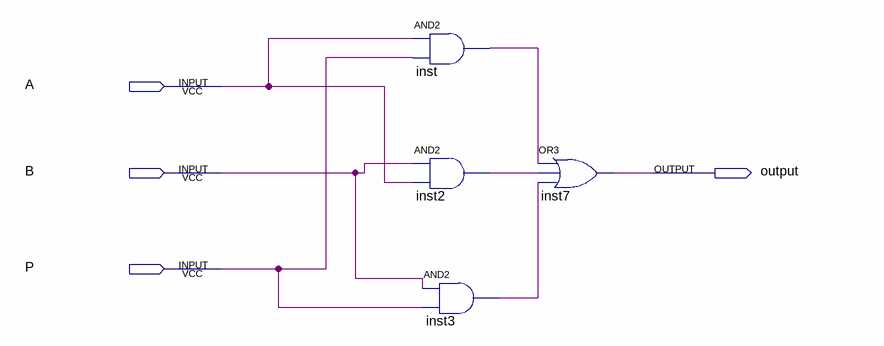
[diagram p0: schematic sheet]
// Quartus schematic Teste.bdf as structural Verilog: 4 symbols, 4 pins
module Teste (
  input  A,
  input  B,
  input  P,
  output \output 
);

  wire inst2_out, inst3_out, inst_out;

  and inst (inst_out, A, P);
  and inst2 (inst2_out, B, A);
  and inst3 (inst3_out, B, P);
  or inst7 (\output , inst_out, inst2_out, inst3_out);
endmodule
